# EAGLE design magnetic-rotary-encoder (EAGLE 4.16)
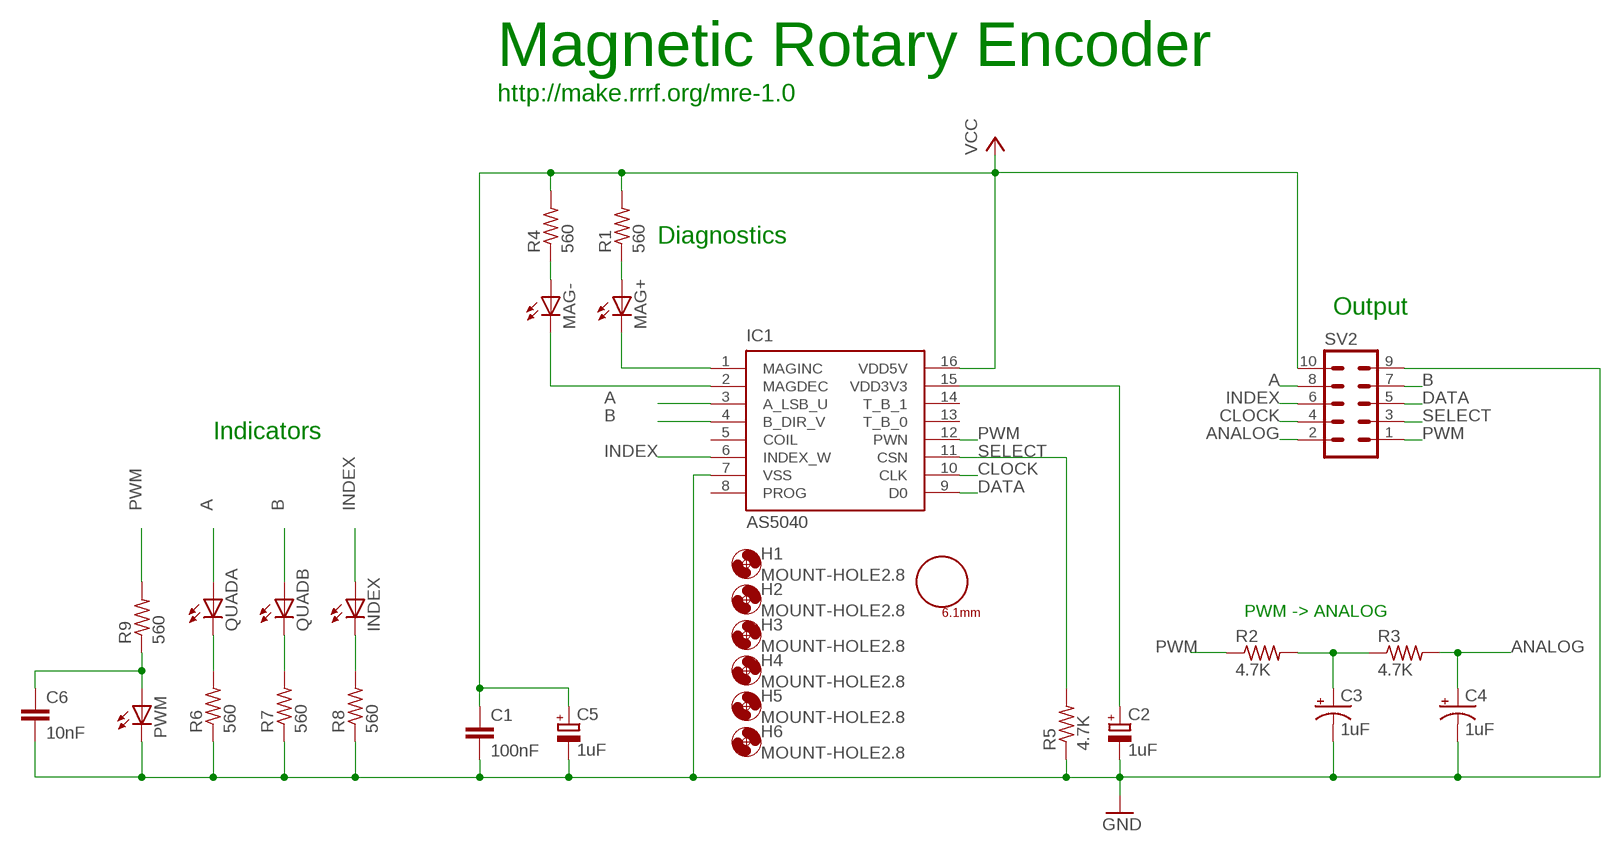
[diagram p0: schematic, sheet 1]

## Parts
C1  100nF  C-EUC1206  [C1206]
C2  1uF  CPOL-EUSANYO_SMD_A5  [SANYO-OSCON_SMD_A5]
C3  1uF  CPOL-USSANYO_SMD_A5  [SANYO-OSCON_SMD_A5]
C4  1uF  CPOL-USSANYO_SMD_A5  [SANYO-OSCON_SMD_A5]
C5  1uF  CPOL-EUSANYO_SMD_A5  [SANYO-OSCON_SMD_A5]
C6  10nF  C-EUC1206  [C1206]
H1  MOUNT-HOLE2.8  [2,8]
H2  MOUNT-HOLE2.8  [2,8]
H3  MOUNT-HOLE2.8  [2,8]
H4  MOUNT-HOLE2.8  [2,8]
H5  MOUNT-HOLE2.8  [2,8]
H6  MOUNT-HOLE2.8  [2,8]
IC1  AS5040  [SSOP16]
INDEX  LEDCHIPLED_1206  [CHIPLED_1206]
MAG+  LEDCHIPLED_1206  [CHIPLED_1206]
MAG-  LEDCHIPLED_1206  [CHIPLED_1206]
PWM  LEDCHIPLED_1206  [CHIPLED_1206]
QUADA  LEDCHIPLED_1206  [CHIPLED_1206]
QUADB  LEDCHIPLED_1206  [CHIPLED_1206]
R1  560  R-US_R1206  [R1206]
R2  4.7K  R-US_R1206  [R1206]
R3  4.7K  R-US_R1206  [R1206]
R4  560  R-US_R1206  [R1206]
R5  4.7K  R-US_R1206  [R1206]
R6  560  R-US_R1206  [R1206]
R7  560  R-US_R1206  [R1206]
R8  560  R-US_R1206  [R1206]
R9  560  R-US_R1206  [R1206]
SV2  ML10  [ML10]
U$1  6.1MMHOLE  [6.1MMHOLE]

## Nets
A: IC1.3(A_LSB_U) QUADA.A SV2.8
ANALOG: C4.+ R3.2 SV2.2
B: IC1.4(B_DIR_V) QUADB.A SV2.7
CLOCK: IC1.10(CLK) SV2.4
DATA: IC1.9(D0) SV2.5
GND: C1.2 C2.- C3.- C4.- C5.- C6.2 IC1.7(VSS) PWM.C R5.1 R6.1 R7.1 R8.1 SV2.9
INDEX: IC1.6(INDEX_W) INDEX.A SV2.6
N$2: C3.+ R2.2 R3.1
N$4: C6.1 PWM.A R9.1
N$7: IC1.1(MAGINC) MAG+.C
N$8: C2.+ IC1.15(VDD3V3)
N$10: IC1.2(MAGDEC) MAG-.C
N$11: MAG+.A R1.1
N$12: MAG-.A R4.1
N$13: QUADA.C R6.2
N$14: QUADB.C R7.2
N$15: INDEX.C R8.2
PWM: IC1.12(PWN) R2.1 R9.2 SV2.1
SELECT: IC1.11(CSN) R5.2 SV2.3
VCC: C1.1 C5.+ IC1.16(VDD5V) R1.2 R4.2 SV2.10
Unconnected: IC1.5(COIL) IC1.8(PROG) IC1.13(T_B_0) IC1.14(T_B_1)

## Notes on the sheet
- Magnetic Rotary Encoder
- http://make.rrrf.org/mre-1.0
- Diagnostics
- Output
- Indicators
- PWM -> ANALOG

## Library data of the parts
C1 C6 = rcl:C-EU: CAPACITOR, European symbol
C2 C5 = rcl:CPOL-EU: POLARIZED CAPACITOR, European symbol
C3 C4 = rcl:CPOL-US: POLARIZED CAPACITOR, American symbol
H1-H6 = holes:MOUNT-HOLE: MOUNTING HOLE with drill center marker
IC1 = austriamicrosystems:AS5040: 10-BIT PROGRAMMABLE MAGNETIC ROTARY ENCODER Source: www.austriamicrosystems.com .. AS5040DataSheetRev12.pdf
INDEX MAG+ MAG- PWM QUADA QUADB = led:LED: LED OSRAM: - CHIPLED LG R971, LG N971, LY N971, LG Q971, LY Q971, LO R971, LY R971 LH N974, LH R974 LS Q976, LO Q976, LY Q976 LO Q996 - Hyper CHIPLED LW Q18S LB Q993, LB Q99A, LB R99A - SideLED LS A670, LO A670, LY A670, LG A670, LP A670 LB A673, LV A673, LT A673, LW A673 LH A674 LY A675 LS A676, LA A676, LO A676, LY A676, LW A676 LS A679, LY A679, LG A679 - Hyper Micro SIDELED® LS Y876, LA Y876, LO Y876, LY Y876 LT Y87S - SmartLED LW L88C, LW L88S LB L89C, LB L89S, LG L890 LS L89K, LO L89K, LY L89K LS L896, LA L896, LO L896, LY L896 - TOPLED LS T670, LO T670, LY T670, LG T670, LP T670 LSG T670, LSP T670, LSY T670, LOP T670, LYG T670 LG T671, LOG T671, LSG T671 LB T673, LV T673, LT T673, LW T673 LH T674 LS T676, LA T676, LO T676, LY T676, LB T676, LH T676, LSB T676, LW T676 LB T67C, LV T67C, LT T67C, LS T67K, LO T67K, LY T67K, LW E67C LS E67B, LA E67B, LO E67B, LY E67B, LB E67C, LV E67C, LT E67C LW T67C LS T679, LY T679, LG T679 LS T770, LO T770, LY T770, LG T770, LP T770 LB T773, LV T773, LT T773, LW T773 LH T774 LS E675, LA E675, LY E675, LS T675 LS T776, LA T776, LO T776, LY T776, LB T776 LHGB T686 LT T68C, LB T68C - Hyper Mini TOPLED® LB M676 - Mini TOPLED Santana® LG M470 LS M47K, LO M47K, LY M47K Source: http://www.osram.convergy.de - LUMILED® LXK2-PW12-R00, LXK2-PW12-S00, LXK2-PW14-U00, LXK2-PW14-V00 LXK2-PM12-R00, LXK2-PM12-S00, LXK2-PM14-U00 LXK2-PE12-Q00, LXK2-PE12-R00, LXK2-PE12-S00, LXK2-PE14-T00, LXK2-PE14-U00 LXK2-PB12-K00, LXK2-PB12-L00, LXK2-PB12-M00, LXK2-PB14-N00, LXK2-PB14-P00, LXK2-PB14-Q00 LXK2-PR12-L00, LXK2-PR12-M00, LXK2-PR14-Q00, LXK2-PR14-R00 LXK2-PD12-Q00, LXK2-PD12-R00, LXK2-PD12-S00 LXK2-PH12-R00, LXK2-PH12-S00 LXK2-PL12-P00, LXK2-PL12-Q00, LXK2-PL12-R00 Source: www.luxeon.com
R1-R9 = rcl:R-US_: RESISTOR, American symbol
SV2 = con-harting-ml:ML10: HARTING
U$1 = reprap:6.1MMHOLE

## Board
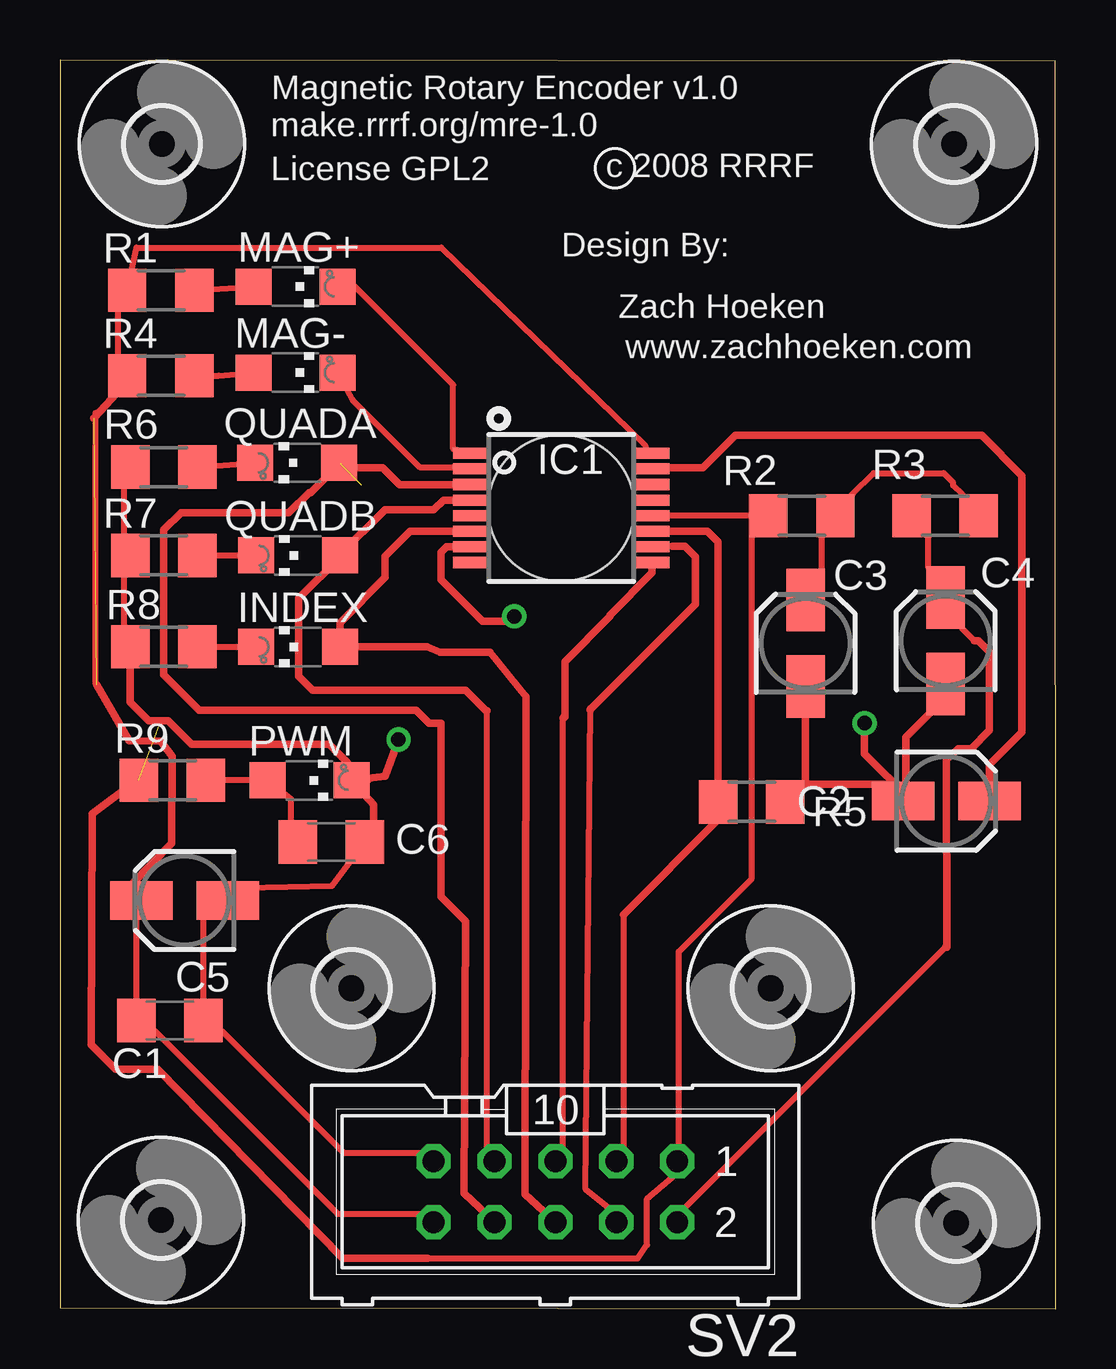
[diagram p1: board, top side]
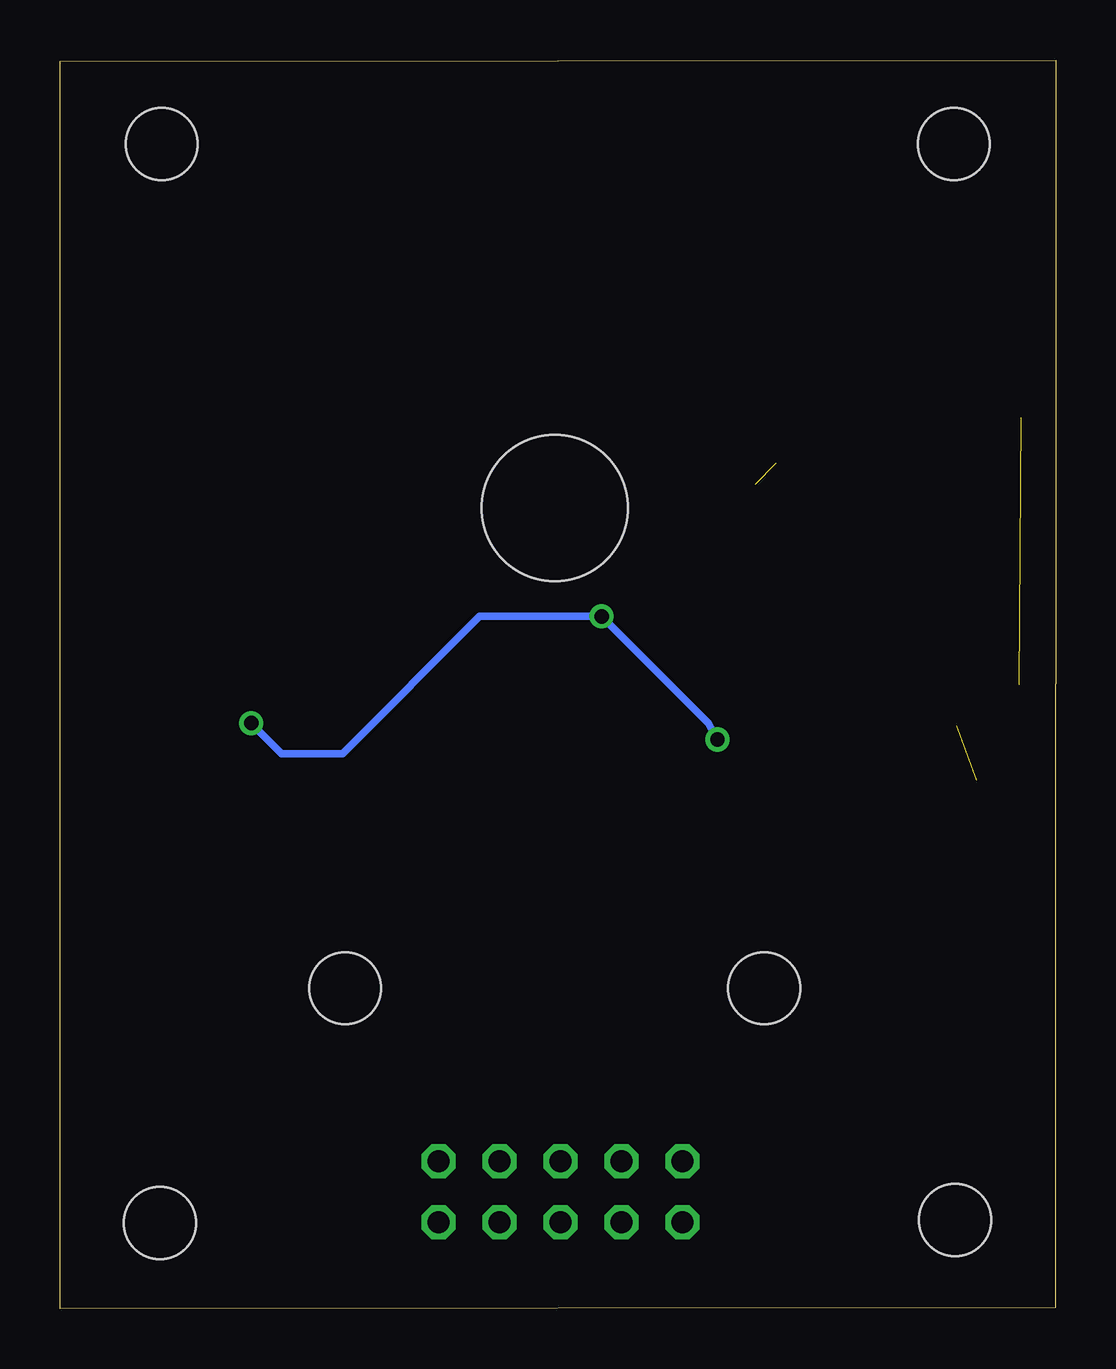
[diagram p2: board, bottom side, seen from below]

Size 41.51 x 52.04 mm. Coordinates in mm from the lower left corner, seen from the top.
Outline: 0.02,0.05 41.51,0 41.5,51.99 0,52.04 0.02,0.05
Copper layers (1*16): Top 0.035mm / dielectric 1.5mm / Bottom 0.035mm
Design rules "default": minimum track width 10mil, minimum drill 24mil, track to track 16mil, track to pad 16mil, pad to pad 16mil, via to via 16mil, smd to smd 8mil, copper to edge 40mil, drill to drill 8mil, minimum pad ring 10mil, minimum via ring 8mil, stop-mask expansion 4mil, vias tented up to drill 0mil, thermal gap 10mil

### Footprints (pad centres in the part's own frame; a part is rotated, then mirrored left to right if it is on the bottom)
C1206 = smd 1.6 x 1.8: 1 -1.4,0; 2 1.4,0
SANYO-OSCON_SMD_A5 = smd 2.6 x 1.6: + 1.8,0; - -1.8,0
3,0 = hole 3: 0,0
SSOP16 = smd 0.46 x 1.43: 1 -2.275,-3.795; 2 -1.625,-3.795; 3 -0.975,-3.795; 4 -0.325,-3.795; 5 0.325,-3.795; 6 0.975,-3.795; 7 1.625,-3.795; 8 2.275,-3.795; 9 2.275,3.795; 10 1.625,3.795; 11 0.975,3.795; 12 0.325,3.795; 13 -0.325,3.795; 14 -0.975,3.795; 15 -1.625,3.795; 16 -2.275,3.795
CHIPLED_1206 = smd 1.5 x 1.5: A 0,-1.75; C 0,1.75
R1206 = smd 1.6 x 1.8: 1 -1.4,0; 2 1.4,0
ML10 = drill 0.914 octagon: 1 -5.08,-1.27; 2 -5.08,1.27; 3 -2.54,-1.27; 4 -2.54,1.27; 5 0,-1.27; 6 0,1.27; 7 2.54,-1.27; 8 2.54,1.27; 9 5.08,-1.27; 10 5.08,1.27
6.1MMHOLE = hole 6.098: 0,0

### Placement (x,y rotation side)
C1  4.58,12.02 0 top
C2  36.94,21.16 0 top
C3  31.08,27.74 90 top
C4  36.92,27.84 90 top
C5  5.19,17.02 180 top
C6  11.32,19.46 0 top
H1  MOUNT-HOLE3.0  [3,0]  4.25,48.54 0 top
H2  MOUNT-HOLE3.0  [3,0]  12.15,13.36 0 top
H3  MOUNT-HOLE3.0  [3,0]  29.63,13.36 0 top
H4  MOUNT-HOLE3.0  [3,0]  37.27,48.54 0 top
H5  MOUNT-HOLE3.0  [3,0]  37.35,3.58 0 top
H6  MOUNT-HOLE3.0  [3,0]  4.2,3.71 0 top
IC1  20.89,33.38 270 top
INDEX  9.92,27.59 90 top
MAG+  9.82,42.6 270 top
MAG-  9.82,39.02 270 top
PWM  10.4,22.03 270 top
QUADA  9.89,35.26 90 top
QUADB  9.92,31.4 90 top
R1  4.2,42.45 180 top
R2  30.92,33.05 0 top
R3  36.89,33.05 180 top
R4  4.2,38.89 180 top
R5  28.83,21.13 180 top
R6  4.33,35.08 0 top
R7  4.33,31.4 0 top
R8  4.33,27.59 0 top
R9  4.69,22.03 180 top
SV2  20.65,4.89 180 top
U$1  20.89,33.38 0 top

### Tracks (layer width: path | path; a pad name or v marks a point on that pad's centre or on a via)
A  (1 unrouted)
  Top 0.305: QUADA.A 11.57,35.33 11.67,35.23 | 18.14,3.62 18.17,3.58 | 18.14,3.62 SV2.8 | 18.14,3.62 16.85,4.83 16.9,16.16 15.89,17.17 15.89,24.41 15.38,24.41 14.85,24.95 5.8,24.95 4.33,26.42 4.33,32.46 5.04,33.18 9.54,33.18 10.38,34.01 10.45,34.01 11.67,35.23 | 11.67,35.23 QUADA.A | IC1.3 14.15,34.35 13.45,35.06 11.95,35.06 11.75,35.26 QUADA.A
ANALOG
  Top 0.254: R3.2 36.21,32.16 36.21,30.89 C4.+ 37.6,28.35 38.11,27.84 | 36.93,15.1 26.05,4.22 SV2.2
  Top 0.305: 38.11,27.84 38.29,27.84 38.75,27.38 38.75,24.11 37.99,23.35 37.45,23.35 36.94,22.89 36.97,15.07 36.93,15.1
B
  Top 0.254: 17.79,24.92 17.79,6.76 SV2.7
  Top 0.305: 17.79,24.92 17.77,24.92 16.9,25.78 10.53,25.78 9.94,26.37 9.94,29.62 11.7,31.35 11.67,31.37 QUADB.A 11.65,31.4 | IC1.4 15.98,33.7 15.58,33.3 13.55,33.3 11.65,31.4 | 11.57,31.32 11.65,31.4
CLOCK
  Top 0.254: 25.54,31.78 25.29,31.78 IC1.10 | 22.11,25.05 22.11,24.97 21.91,4.98 22.87,4.22 SV2.4
  Top 0.305: 25.54,31.78 26.05,31.78 26.48,31.35 26.48,29.37 22.09,24.97 | 22.09,24.97 | 22.11,24.97 22.09,24.97
DATA
  Top 0.254: 20.97,24.67 20.97,24.62 20.97,6.76 SV2.5
  Top 0.305: IC1.9 24.69,30.67 22.92,28.91 22.92,28.86 21.04,26.98 21.04,24.67 20.99,24.62 20.97,24.62
GND  (via drill 0.6)
  Top 0.254: R8.1 2.68,28.48 2.68,30.51 R7.1 2.68,32.29 2.68,34.32 R6.1 | C6.2 11.34,17.63 7.63,17.55 C5.- 5.98,16.79 5.98,13.24 C1.2 6.74,11.59 11.82,6.51 15,6.51 SV2.9
  Top 0.305: R5.1 30.23,21.09 30.26,21.06 31.08,21.87 | 31.08,21.87 C3.- 31.08,25.63 | C2.- 35.12,21.16 34.4,21.87 31.08,21.87 | C4.- 36.92,25.48 35.27,23.83 35.27,21.29 C2.- | IC1.7 16.12,31.75 15.89,31.52 15.89,30.38 17.61,28.65 18.73,28.65 v18.94,28.86 | C2.- 35.37,21.16 35.45,21.24 33.54,23.14 v33.54,24.41 | PWM.C 13.55,22.2 v14.11,23.73 | C6.2 13.07,20.32 13.07,21.01 PWM.C | 2.93,27.67 2.88,27.71 | 2.93,27.67 R8.1 | 2.93,27.67 2.93,25.28 3.7,24.51 4.51,24.51 5.5,23.52 11.21,23.52 12.76,21.97 12.84,22.05 PWM.C
  Top 0.406: C3.- 31.48,25.94
  Bottom 0.305: v14.11,23.73 14.49,24.41 v18.94,28.86 24.02,28.86 29.73,23.14 32.27,23.14 v33.54,24.41
INDEX
  Top 0.305: SV2.6 19.39,4.78 19.42,25.5 17.92,27.36 15.84,27.36 15.3,27.59 INDEX.A | INDEX.A 11.62,27.59 11.59,27.56 | INDEX.A 11.67,28.6 13.55,30.48 13.55,31.37 14.59,32.41 17.06,32.41 17.08,32.44 17.1,32.42 IC1.6
N$2
  Top 0.254: C3.+ 31.76,30.76 31.76,32.16 R2.2 33.03,33.94 33.92,34.83 36.84,34.83 37.22,34.45 37.22,34.32 37.6,33.94 37.66,33.84 R3.1
N$4
  Top 0.254: C6.1 9.64,20.35 9.64,21.24 PWM.A R9.1
N$7
  Top 0.254: IC1.1 16.4,35.84 16.4,38.51 12.2,42.7 MAG+.C
N$8
  Top 0.254: 25.67,35.08 25.29,35.08 IC1.15
  Top 0.305: C2.+ 38.74,22.68 40.09,24.03 40.09,34.72 38.42,36.4 28.16,36.4 26.81,35.06 24.96,35.06 24.9,35 IC1.15
N$10
  Top 0.254: IC1.2 16.4,35.08 15,35.08 12.2,37.87 MAG-.C
N$11
  Top 0.254: R1.1 MAG+.A
N$12
  Top 0.254: MAG-.A 6.62,38.89 R4.1
N$13
  Top 0.254: R6.2 QUADA.C
N$14
  Top 0.254: R7.2 QUADB.C
N$15
  Top 0.254: R8.2 INDEX.C
PWM  (1 unrouted)
  Top 0.254: IC1.12 25.29,33.05 R2.1 28.84,32.16 28.84,17.94 25.79,14.89 25.79,6.76 SV2.1 25.54,5.49 24.47,4.6 24.47,2.67 24.09,2.11 15.33,2.11
  Top 0.305: 15.33,2.11 11.77,2.11 4.08,9.99 2.32,9.99 1.31,11 1.33,20.63 3.24,22.05 R9.2
SELECT
  Top 0.254: 25.67,32.41 25.29,32.41 IC1.11 | 23.51,16.44 23.51,6.76 SV2.3
  Top 0.305: IC1.11 25,32.4 25.03,32.44 25.06,32.41 26.99,32.41 27.43,31.97 R5.2 27.43,20.38 23.48,16.44 23.51,16.44
VCC  (1 unrouted)
  Top 0.254: IC1.16 24.4,35.84 24.4,35.97 15.89,44.22 3.19,44.22 R1.2 2.43,42.45 2.43,39.53 R4.2 | C5.+ 3.19,16.79 3.19,13.24 C1.1 3.95,11.59 11.57,3.97 15,3.97 SV2.10 | 1.7,37.43 1.49,37.34 1.49,26.06 1.52,26
  Top 0.305: R4.2 2.8,38.63 1.7,37.43 1.41,37.11 | C5.+ 2.68,17.55 2.96,17.68 4.66,19.41 4.69,23.04 4.2,23.65 2.88,23.68 1.52,26 | 1.43,37.14 | 1.43,37.14

### Text on the board
tPlace: Magnetic Rotary Encoder v1.0 | make.rrrf.org/mre-1.0 | License GPL2 | c 2008 RRRF | Design By: | Zach Hoeken | www.zachhoeken.com